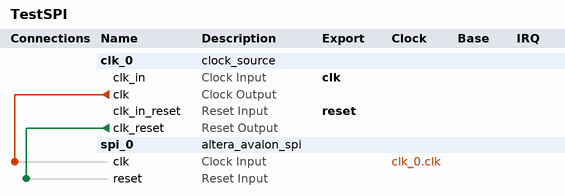
[diagram p0: system contents]
# Platform Designer (Qsys) system TestSPI
# Parameters at their usual value, and those the tool derives, are not listed.
package require -exact qsys 11.1
create_system TestSPI
set_project_property DEVICE_FAMILY CYCLONEII

add_instance clk_0 clock_source 11.1
set_instance_parameter_value clk_0 clockFrequency 25175000

add_instance spi_0 altera_avalon_spi 11.1
set_instance_parameter_value spi_0 clockPolarity 0
set_instance_parameter_value spi_0 dataWidth 8
set_instance_parameter_value spi_0 masterSPI true
set_instance_parameter_value spi_0 numberOfSlaves 2
set_instance_parameter_value spi_0 targetClockRate 128000

# connections
add_connection clk_0.clk spi_0.clk clock
add_connection clk_0.clk_reset spi_0.reset reset

# exported interfaces
add_interface clk clock sink
set_interface_property clk EXPORT_OF clk_0.clk_in
add_interface reset reset sink
set_interface_property reset EXPORT_OF clk_0.clk_in_reset

save_system TestSPI.qsys
